# Altium project prjChassi.PrjPcb
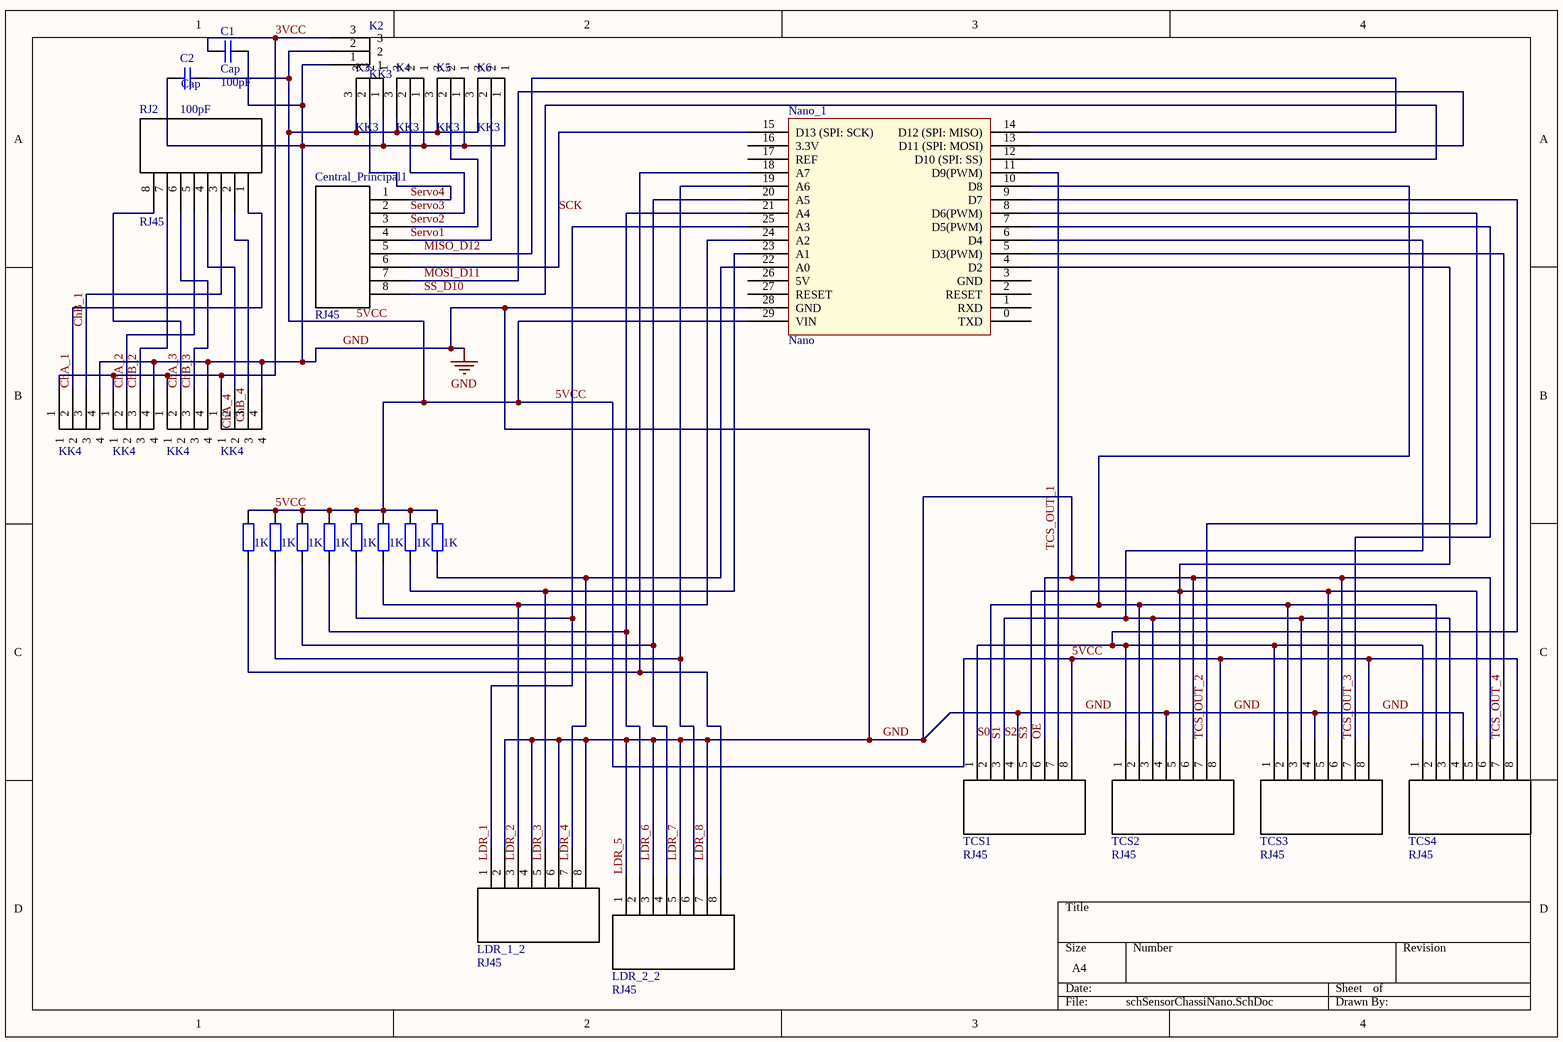
[diagram p0: schSensorChassiNano.SchDoc]
1 sheet, 28 parts. Net scope: global (net labels, ports and power ports of the same name join across sheets).
Board file: pcbSensorChassiNano.PcbDoc

## Sheet schSensorChassiNano.SchDoc
size A4

### Parts
C1  Cap  value 100pF  [RAD-0.3]
C2  Cap  value 100pF  [RAD-0.3]
Central_Principal1  RJ45  [RJ45_Simples]
Encoder_4  KK4  [4-vias]
Encoder_5  KK4  [4-vias]
Encoder_6  KK4  [4-vias]
K1  KK4  [4-vias]
K2  KK3  [3-vias]
K3  KK3  [3-vias]
K4  KK3  [3-vias]
K5  KK3  [3-vias]
K6  KK3  [3-vias]
LDR_1_2  RJ45  [RJ45_Simples]
LDR_2_2  RJ45  [RJ45_Simples]
Nano_1  Nano  [Arduino_Nano]
R17  value 1K  [AXIAL-0.4]  (hidden comment: Res2)
R18  value 1K  [AXIAL-0.4]  (hidden comment: Res2)
R19  value 1K  [AXIAL-0.4]  (hidden comment: Res2)
R20  value 1K  [AXIAL-0.4]  (hidden comment: Res2)
R21  value 1K  [AXIAL-0.4]  (hidden comment: Res2)
R22  value 1K  [AXIAL-0.4]  (hidden comment: Res2)
R23  value 1K  [AXIAL-0.4]  (hidden comment: Res2)
R24  value 1K  [AXIAL-0.4]  (hidden comment: Res2)
RJ2  RJ45  [RJ45_Simples]
TCS1  RJ45  [RJ45_Simples]
TCS2  RJ45  [RJ45_Simples]
TCS3  RJ45  [RJ45_Simples]
TCS4  RJ45  [RJ45_Simples]

### Nets
GND: C1.2 C2.1 Encoder_4.4 Encoder_5.4 Encoder_6.4 K1.4 K2.1 K3.1 K4.1 K5.1 K6.1 LDR_1_2.2 LDR_1_2.4 LDR_1_2.6 LDR_1_2.8 LDR_2_2.1 LDR_2_2.3 LDR_2_2.5 LDR_2_2.7 Nano_1.28(GND) TCS1.4 TCS1.6 TCS2.4 TCS2.6 TCS3.4 TCS3.6 TCS4.4 TCS4.6  [also labelled LDR_5, LDR_6, LDR_7, LDR_8, OE]
3VCC: C1.1 Encoder_4.1 Encoder_5.1 Encoder_6.1 K1.1 K2.3
5VCC: C2.2 K2.2 K3.3 K4.3 K5.3 K6.3 Nano_1.29(VIN) R17.2 R18.2 R19.2 R20.2 R21.2 R22.2 R23.2 R24.2 TCS1.8 TCS2.8 TCS3.8 TCS4.8
ChA_1: K1.2 RJ2.1
ChA_2: Encoder_4.2 RJ2.5
ChA_3: Encoder_5.2 RJ2.8
ChB_1: K1.3 RJ2.3
ChB_2: Encoder_4.3 RJ2.7
ChB_3: Encoder_5.3 RJ2.6
MISO_D12: Central_Principal1.5 Nano_1.14(D12_(SPI:_MISO))
MOSI_D11: Central_Principal1.7 Nano_1.13(D11_(SPI:_MOSI))
S0: Nano_1.9(D7) TCS1.1 TCS2.1 TCS3.1 TCS4.1
S1: Nano_1.6(D4) TCS1.3 TCS2.3 TCS3.3 TCS4.3  [also labelled S2]
S3: Nano_1.4(D2) TCS1.5 TCS2.5 TCS3.5 TCS4.5
SCK: Central_Principal1.6 Nano_1.15(D13_(SPI:_SCK))
Servo1: Central_Principal1.4 K6.2
Servo2: Central_Principal1.3 K5.2
Servo3: Central_Principal1.2 K4.2
Servo4: Central_Principal1.1 K3.2
SS_D10: Central_Principal1.8 Nano_1.12(D10_(SPI:_SS))
TCS_OUT_1: Nano_1.11(D9(PWM)) TCS1.7
TCS_OUT_2: Nano_1.8(D6(PWM)) TCS2.7
TCS_OUT_3: Nano_1.7(D5(PWM)) TCS3.7
TCS_OUT_4: Nano_1.5(D3(PWM)) TCS4.7
NetEncoder_6_2: Encoder_6.2 RJ2.4
NetEncoder_6_3: Encoder_6.3 RJ2.2
NetLDR_1_2_1: LDR_1_2.1 Nano_1.25(A3) R21.1
NetLDR_1_2_3: LDR_1_2.3 Nano_1.24(A2) R22.1
NetLDR_1_2_5: LDR_1_2.5 Nano_1.23(A1) R23.1
NetLDR_1_2_7: LDR_1_2.7 Nano_1.22(A0) R24.1
NetLDR_2_2_2: LDR_2_2.2 Nano_1.21(A4) R20.1
NetLDR_2_2_4: LDR_2_2.4 Nano_1.20(A5) R19.1
NetLDR_2_2_6: LDR_2_2.6 Nano_1.19(A6) R18.1
NetLDR_2_2_8: LDR_2_2.8 Nano_1.18(A7) R17.1
NetNano_1_10: Nano_1.10(D8) TCS1.2 TCS2.2 TCS3.2 TCS4.2

Not connected (* = marked no-connect by the designer): Nano_1 0(TXD) 1(RXD) 2(RESET) 3(GND) 16(3.3V) 17(REF) 26(5V) 27(RESET)

### Notes on the sheet
- Labels drawn without touching a wire or pin: ChA_4, ChB_4, LDR_1, LDR_2, LDR_3, LDR_4

### Library data of the parts
C1 C2 = Cap: Capacitor; Published: 8-Jun-2000; LatestRevisionDate: 17-Jul-2002; LatestRevisionNote: Re-released for DXP Platform.; PackageReference: RAD-0.3; Publisher: Altium Limited; PackageDescription: Radial Cap, Thru-Hole; 2 Leads; 0.3 in Pin Spacing
Encoder_4-Encoder_6 K1 = KK4Vias: ComponentLink1Description: Fabricante; ComponentLink1URL: https://www.molex.com/molex/products/family?key=kk_254_rpc_connector_system&channel=products&chanName=family&pageTitle=Introduction&parentKey=kk_interconnect_solutions
K2-K6 = KK3Vias
Nano_1 = Arduino_Nano
R17-R24 = Res2: Resistor; Published: 8-Jun-2000; LatestRevisionDate: 17-Jul-2002; LatestRevisionNote: Re-released for DXP Platform.; PackageReference: AXIAL-0.4; Publisher: Altium Limited; PackageDescription: Axial Device, Thru-Hole; 2 Leads; 0.4 in Pin Spacing